# Altium project Relay-Driver-Board-v1.0.PrjPcb (part 1 of 5)
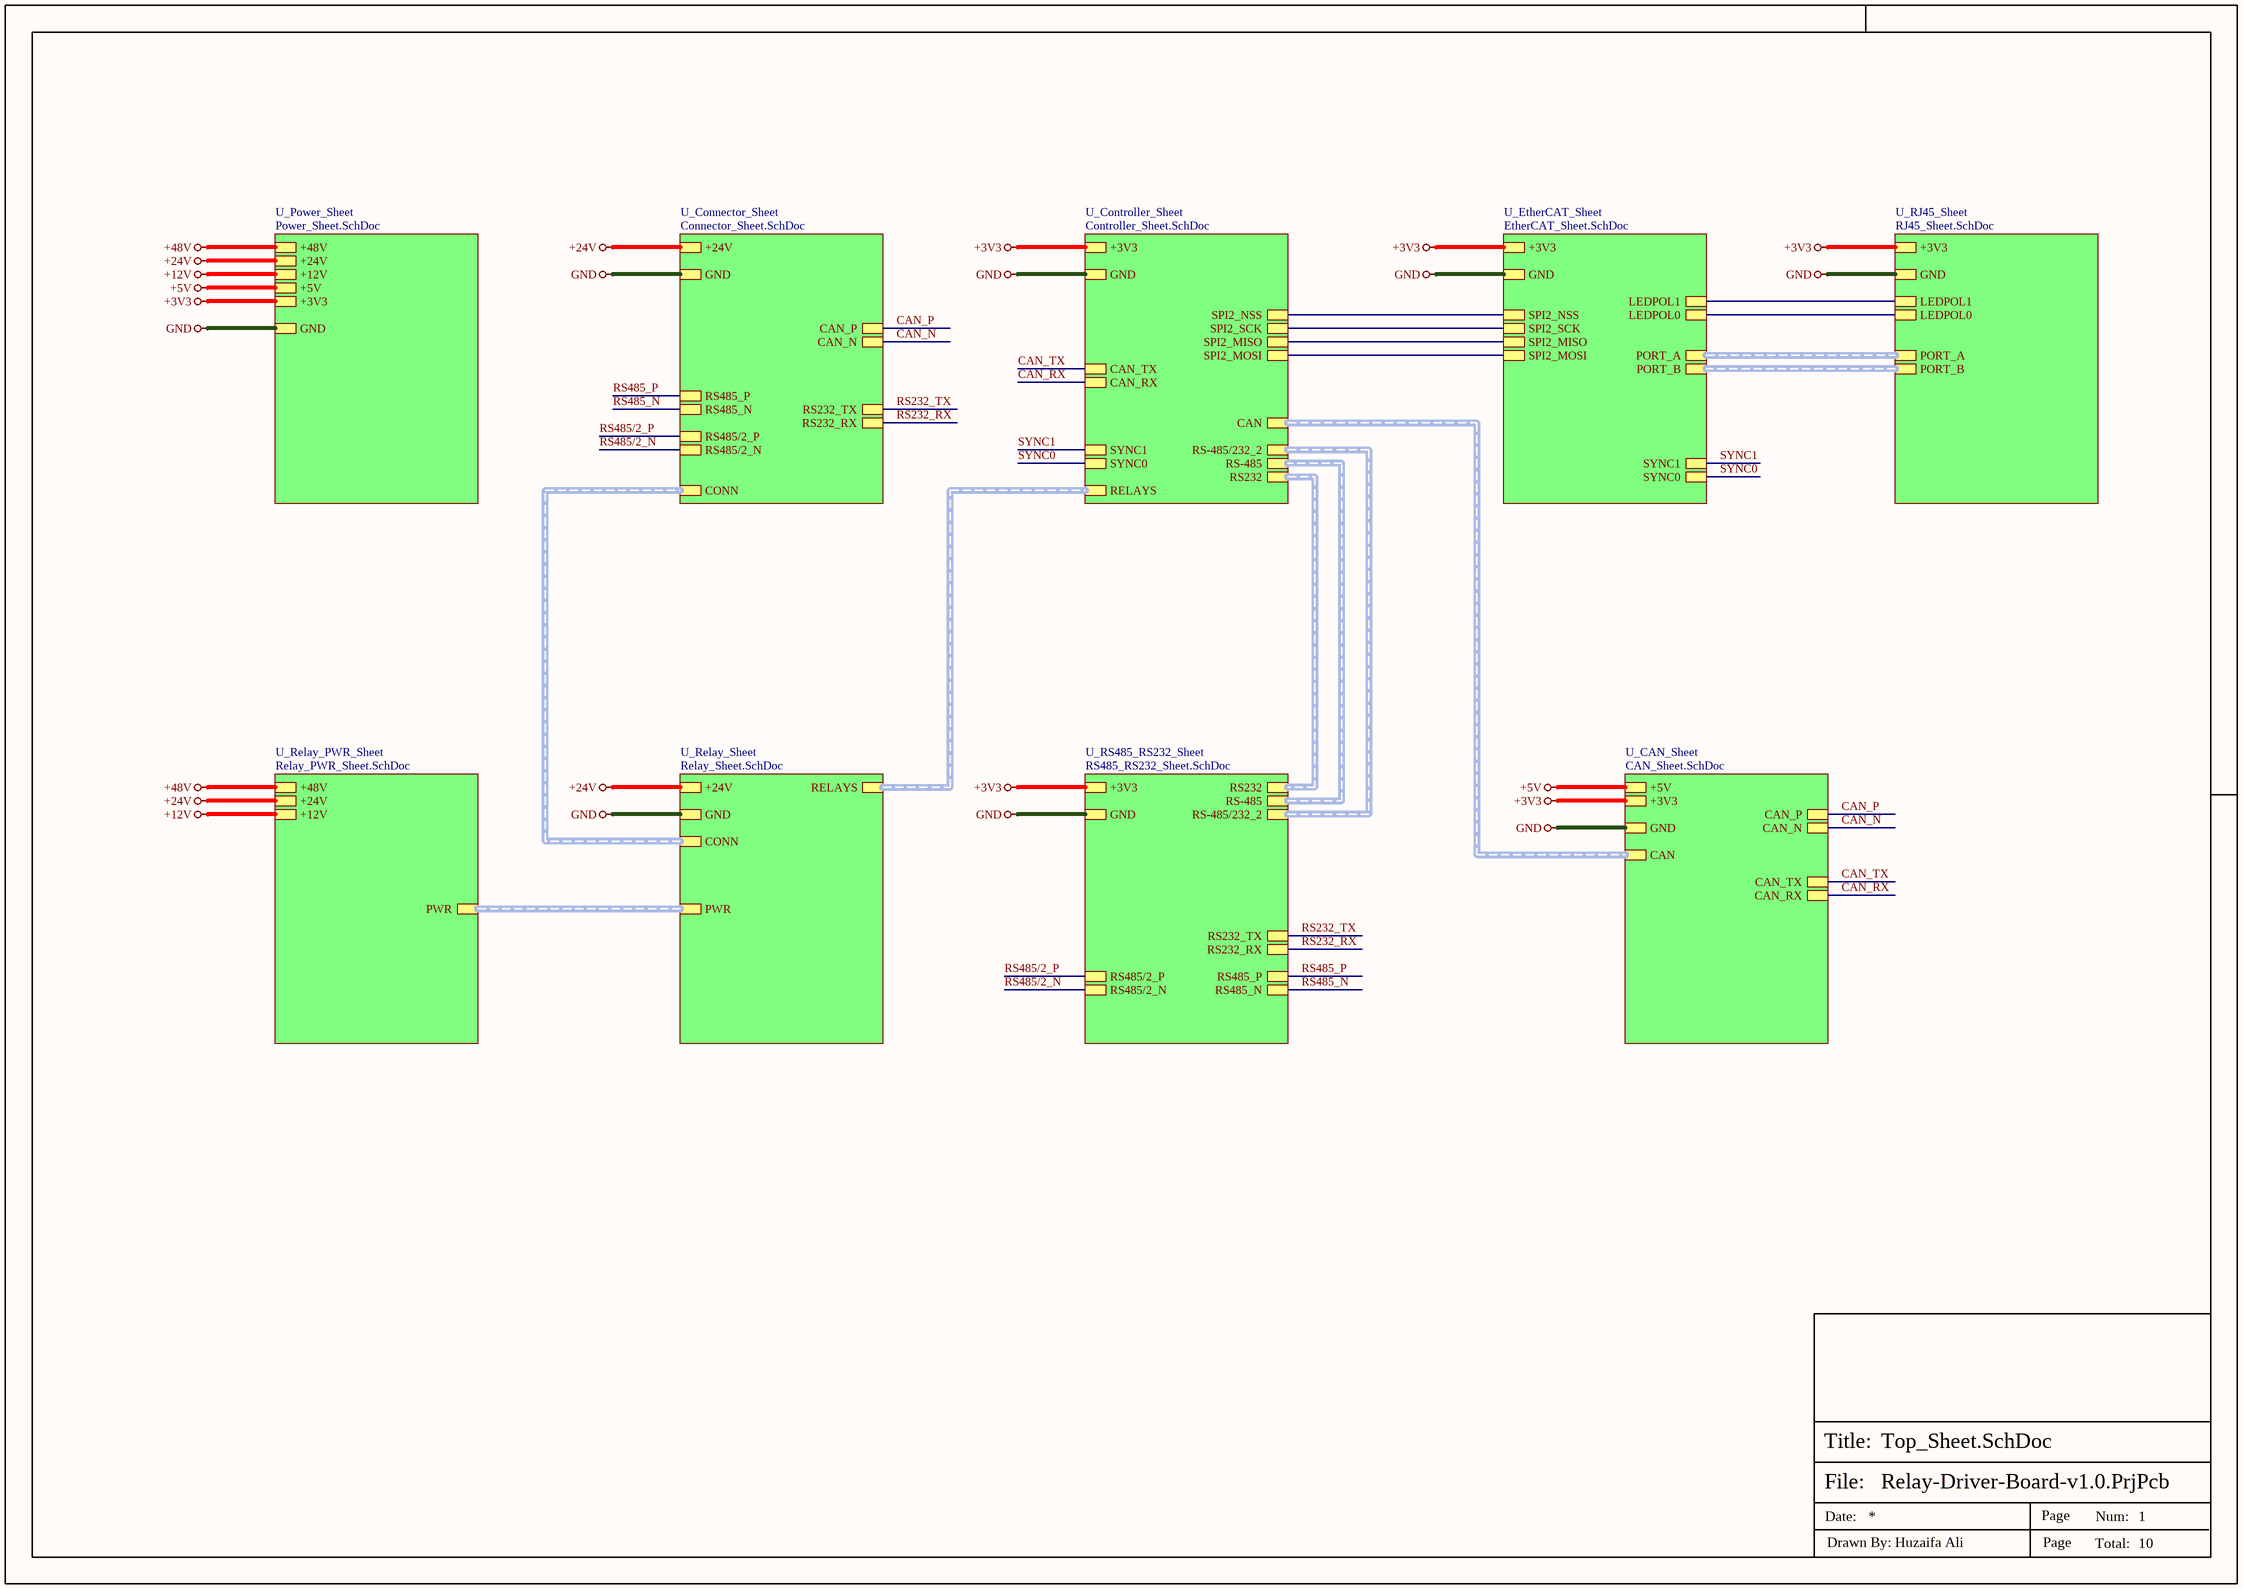
[diagram p0: Top_Sheet.SchDoc]
10 sheets, 294 parts. Net scope: hierarchical (ports join the sheet entries above them; power ports are global).
Sheets:
  Top_Sheet.SchDoc
    U_CAN_Sheet = CAN_Sheet.SchDoc
    U_Connector_Sheet = Connector_Sheet.SchDoc
    U_Controller_Sheet = Controller_Sheet.SchDoc
    U_EtherCAT_Sheet = EtherCAT_Sheet.SchDoc
    U_Power_Sheet = Power_Sheet.SchDoc
    U_Relay_PWR_Sheet = Relay_PWR_Sheet.SchDoc
    U_Relay_Sheet = Relay_Sheet.SchDoc
    U_RS485_RS232_Sheet = RS485_RS232_Sheet.SchDoc
    U_RJ45_Sheet = RJ45_Sheet.SchDoc

## Sheet Top_Sheet.SchDoc
size 420 x 297 mm; SheetNumber: 1; SheetTotal: 10

### Sub-sheets
U_CAN_Sheet = CAN_Sheet.SchDoc: CAN (harness CAN), CAN_RX, CAN_TX, CAN_P, CAN_N, +5V, +3V3, GND
U_Connector_Sheet = Connector_Sheet.SchDoc: RS485/2_N, RS485/2_P, RS485_N, RS485_P, RS232_RX, RS232_TX, CAN_P, CAN_N, GND, +24V, CONN (harness CONN)
U_Controller_Sheet = Controller_Sheet.SchDoc: SPI2_SCK, SPI2_NSS, SPI2_MISO, SPI2_MOSI, RS-485/232_2 (harness RS-485/232_2), RS232 (harness RS232), +3V3, GND, RS-485 (harness RS-485), CAN_RX, CAN_TX, CAN (harness CAN), RELAYS (harness RELAYS), SYNC0, SYNC1
U_EtherCAT_Sheet = EtherCAT_Sheet.SchDoc: PORT_A (harness PORT_A), PORT_B (harness PORT_B), LEDPOL0, LEDPOL1, SPI2_SCK, SPI2_NSS, SPI2_MISO, SPI2_MOSI, +3V3, GND, SYNC0, SYNC1
U_Power_Sheet = Power_Sheet.SchDoc: +12V, +5V, +3V3, GND, +24V, +48V
U_Relay_PWR_Sheet = Relay_PWR_Sheet.SchDoc: PWR (harness PWR), +12V, +24V, +48V
U_Relay_Sheet = Relay_Sheet.SchDoc: RELAYS (harness RELAYS), CONN (harness CONN), PWR (harness PWR), GND, +24V
U_RJ45_Sheet = RJ45_Sheet.SchDoc: PORT_A (harness PORT_A), PORT_B (harness PORT_B), LEDPOL0, LEDPOL1, +3V3, GND
U_RS485_RS232_Sheet = RS485_RS232_Sheet.SchDoc: RS485_N, RS485_P, RS232_RX, RS232_TX, RS-485 (harness RS-485), +3V3, GND, RS485/2_N, RS485/2_P, RS-485/232_2 (harness RS-485/232_2), RS232 (harness RS232)

### Nets
+3V3: sheet U_CAN_Sheet/+3V3, sheet U_Controller_Sheet/+3V3, sheet U_EtherCAT_Sheet/+3V3, sheet U_Power_Sheet/+3V3, sheet U_RS485_RS232_Sheet/+3V3, sheet U_RJ45_Sheet/+3V3
+5V: sheet U_CAN_Sheet/+5V, sheet U_Power_Sheet/+5V
+12V: sheet U_Power_Sheet/+12V, sheet U_Relay_PWR_Sheet/+12V
+24V: sheet U_Connector_Sheet/+24V, sheet U_Power_Sheet/+24V, sheet U_Relay_PWR_Sheet/+24V, sheet U_Relay_Sheet/+24V
+48V: sheet U_Power_Sheet/+48V, sheet U_Relay_PWR_Sheet/+48V
CAN_RX: sheet U_CAN_Sheet/CAN_RX, sheet U_Controller_Sheet/CAN_RX
CAN_TX: sheet U_CAN_Sheet/CAN_TX, sheet U_Controller_Sheet/CAN_TX
GND: sheet U_CAN_Sheet/GND, sheet U_Connector_Sheet/GND, sheet U_Controller_Sheet/GND, sheet U_EtherCAT_Sheet/GND, sheet U_Power_Sheet/GND, sheet U_Relay_Sheet/GND, sheet U_RS485_RS232_Sheet/GND, sheet U_RJ45_Sheet/GND
RS232_RX: sheet U_Connector_Sheet/RS232_RX, sheet U_RS485_RS232_Sheet/RS232_RX
RS232_TX: sheet U_Connector_Sheet/RS232_TX, sheet U_RS485_RS232_Sheet/RS232_TX
CAN_N: sheet U_CAN_Sheet/CAN_N, sheet U_Connector_Sheet/CAN_N
CAN_P: sheet U_CAN_Sheet/CAN_P, sheet U_Connector_Sheet/CAN_P
LEDPOL0: sheet U_EtherCAT_Sheet/LEDPOL0, sheet U_RJ45_Sheet/LEDPOL0
LEDPOL1: sheet U_EtherCAT_Sheet/LEDPOL1, sheet U_RJ45_Sheet/LEDPOL1
RS485/2_N: sheet U_Connector_Sheet/RS485/2_N, sheet U_RS485_RS232_Sheet/RS485/2_N
RS485/2_P: sheet U_Connector_Sheet/RS485/2_P, sheet U_RS485_RS232_Sheet/RS485/2_P
RS485_N: sheet U_Connector_Sheet/RS485_N, sheet U_RS485_RS232_Sheet/RS485_N
RS485_P: sheet U_Connector_Sheet/RS485_P, sheet U_RS485_RS232_Sheet/RS485_P
SPI2_MISO: sheet U_Controller_Sheet/SPI2_MISO, sheet U_EtherCAT_Sheet/SPI2_MISO
SPI2_MOSI: sheet U_Controller_Sheet/SPI2_MOSI, sheet U_EtherCAT_Sheet/SPI2_MOSI
SPI2_NSS: sheet U_Controller_Sheet/SPI2_NSS, sheet U_EtherCAT_Sheet/SPI2_NSS
SPI2_SCK: sheet U_Controller_Sheet/SPI2_SCK, sheet U_EtherCAT_Sheet/SPI2_SCK
SYNC0: sheet U_Controller_Sheet/SYNC0, sheet U_EtherCAT_Sheet/SYNC0
SYNC1: sheet U_Controller_Sheet/SYNC1, sheet U_EtherCAT_Sheet/SYNC1

### Buses and harness runs
harness sheet U_CAN_Sheet/CAN = sheet U_Controller_Sheet/CAN
harness sheet U_Connector_Sheet/CONN = sheet U_Relay_Sheet/CONN
harness sheet U_Controller_Sheet/RELAYS = sheet U_Relay_Sheet/RELAYS
harness sheet U_Controller_Sheet/RS232 = sheet U_RS485_RS232_Sheet/RS232
harness sheet U_Controller_Sheet/RS-485 = sheet U_RS485_RS232_Sheet/RS-485
harness sheet U_Controller_Sheet/RS-485/232_2 = sheet U_RS485_RS232_Sheet/RS-485/232_2
harness sheet U_EtherCAT_Sheet/PORT_A = sheet U_RJ45_Sheet/PORT_A
harness sheet U_EtherCAT_Sheet/PORT_B = sheet U_RJ45_Sheet/PORT_B
harness sheet U_Relay_PWR_Sheet/PWR = sheet U_Relay_Sheet/PWR

### Notes on the sheet
- File:
- Title:
- Date:
- Page
- Num:
- Total:
- Drawn By: Huzaifa Ali

## Sheet CAN_Sheet.SchDoc
size 420 x 297 mm; SheetNumber: 4; SheetTotal: 10
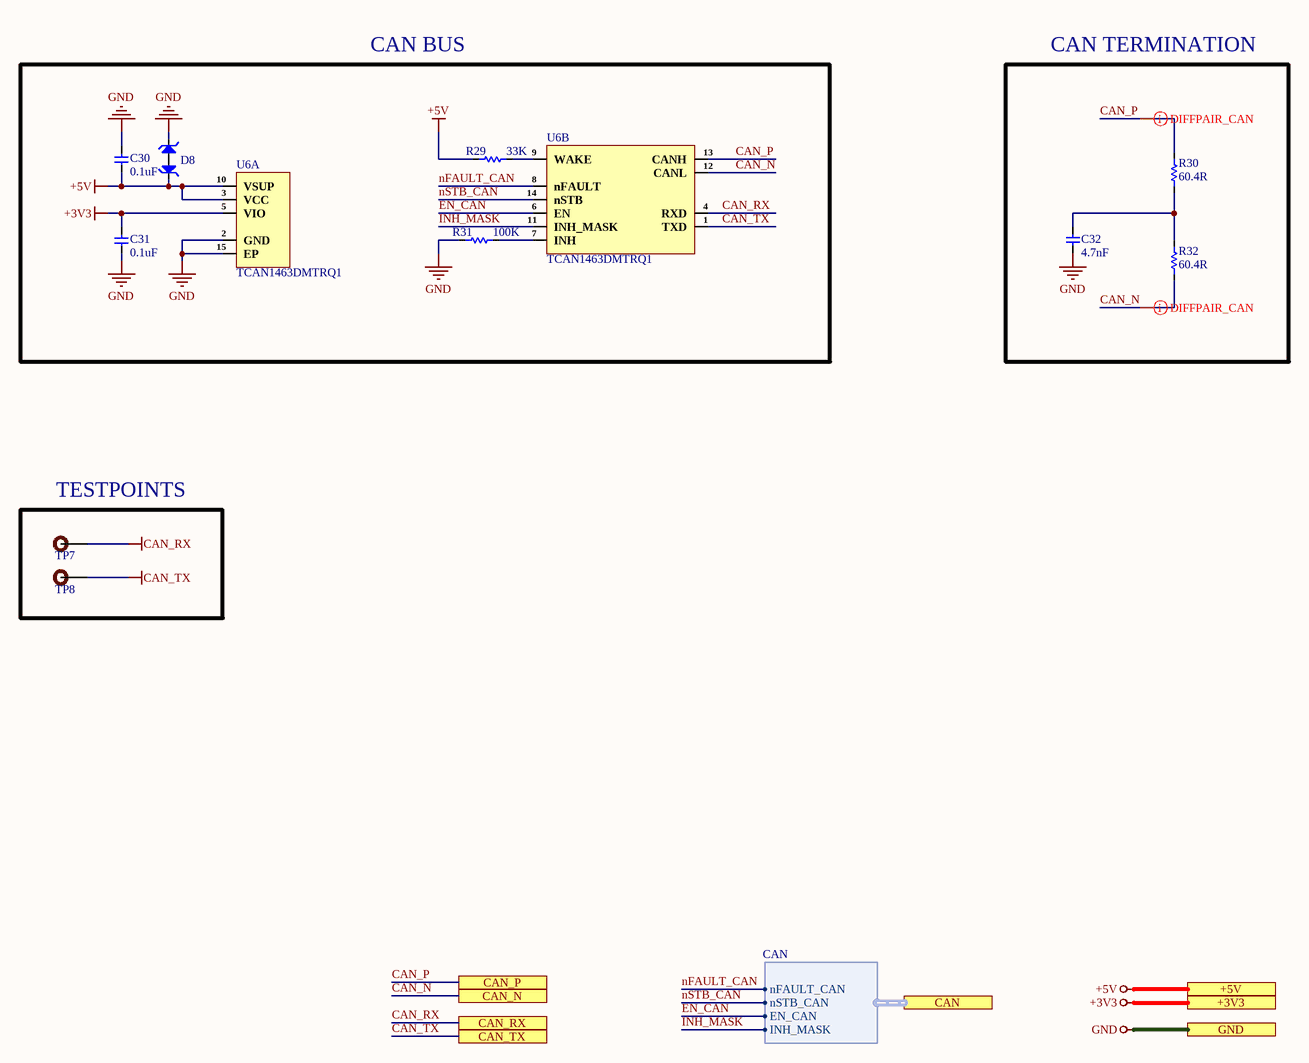
[diagram p1: CAN_Sheet.SchDoc]

### Parts
C30  0.1uF  [Cap-0402]
C31  0.1uF  [Cap-0402]
C32  4.7nF  [Cap-0402]
D8  PESD5V0H1BSFYL  [DSN0603-2]  (value not drawn)
R29  33K  [Res-0402]
R30  60.4R  [Res-0603]
R31  100K  [Res-0402]
R32  60.4R  [Res-0603]
TP7  TEST POINT  [Test-point]  (value not drawn)  (no BOM)
TP8  TEST POINT  [Test-point]  (value not drawn)  (no BOM)
U6  TCAN1463DMTRQ1  [VSON-14(3x4.5)]  (parts A,B of 2)

### Ports
+3V3 (see Top_Sheet[5C], Controller_Sheet[5D], EtherCAT_Sheet[5D], Power_Sheet[5D], RJ45_Sheet[5D], RS485_RS232_Sheet[5D]), +5V (see Top_Sheet[5B], Power_Sheet[5D]), CAN (harness CAN, see Top_Sheet[5C], Controller_Sheet[3D]), CAN_N (see Top_Sheet[5C], Connector_Sheet[3D]), CAN_P (see Top_Sheet[5C], Connector_Sheet[3D]), CAN_RX (see Top_Sheet[5C], Controller_Sheet[2D]), CAN_TX (see Top_Sheet[5C], Controller_Sheet[2D]), GND (see Top_Sheet[5C], Connector_Sheet[5D], Controller_Sheet[5D], EtherCAT_Sheet[5D], Power_Sheet[5D], Relay_Sheet[5D], RJ45_Sheet[5D], RS485_RS232_Sheet[5D])

### Harnesses
CAN: nFAULT_CAN, nSTB_CAN, EN_CAN, INH_MASK

### Nets
+3V3: C31.2 U6.5(VIO) ; port +3V3
+5V: C30.1 D8.1 R29.1 U6.3(VCC) U6.10(VSUP) ; port +5V
CAN_RX: TP7.1 U6.4(RXD) ; port CAN_RX
CAN_TX: TP8.1 U6.1(TXD) ; port CAN_TX
GND: C30.2 C31.1 C32.2 D8.2 R31.1 U6.2(GND) U6.15(EP) ; port GND
CAN_N: R32.2 U6.12(CANL) ; port CAN_N
CAN_P: R30.1 U6.13(CANH) ; port CAN_P
EN_CAN: U6.6(EN) ; port CAN.EN_CAN
INH_MASK: U6.11(INH_MASK) ; port CAN.INH_MASK
nFAULT_CAN: U6.8(nFAULT) ; port CAN.nFAULT_CAN
nSTB_CAN: U6.14(nSTB) ; port CAN.nSTB_CAN
NetC32_1: C32.1 R30.2 R32.1
NetR29_2: R29.2 U6.9(WAKE)
NetR31_2: R31.2 U6.7(INH)

### Layout directives
differential pair; net class CAN; differential pair class CAN_Lines: CAN_N, CAN_P

### Notes on the sheet
- CAN BUS
- CAN TERMINATION
- (near TP7) TESTPOINTS
- File:
- Title:
- Date:
- Page
- Num:
- Total:
- Drawn By: Huzaifa Ali

### Library data of the parts
C30 C31 = CC0402JRX7R7BB104: CAP CER 0.1UF 16V X7R 0402; Manufacturer: Yageo; Material: 4241ConductorMaterial; Value: 100nF; Tolerance: 5%; Item Type: Capacitor; Supplier: Digikey; Supplier Part Number: 311-1676-1-ND; Manufacturer Part Number: CC0402JRX7R7BB104; RoHS: Yes; Category: Ceramic Capacitors; Stock: 1659111; Pricing: 1=0.1, 10=0.046, 50=0.0262, 100=0.0203, 500=0.01528, 1000=0.012, 2500=0.01091, 5000=0.01004 (USD); Mounting Technology: Surface Mount; Case/Package: 0402; Case Code (Metric): 1005; Case Code (Imperial): 0402; Min Operating Temperature: -55°C; Max Operating Temperature: 125°C; Dielectric: X7R; Packaging: Tape and Reel; Package Quantity: 10000; Voltage Rating (DC): 16V; Voltage Rating: 16V; Series: CC; Construction: Flat; Length: 0.039inch; Width: 0.02inch; Height: 0.5mm; Thickness: 0.022inch; Lead Free: Lead Free; Halogen Free: Halogen Free; RoHS Compliant: Yes; ComponentLink1URL: https://datasheet.ciiva.com/13210/upy-gphc-x7r-6-3v-to-50v-8-12304-13210152.pdf?src-supplier=Mouser; ComponentLink1Description: https://datasheet.ciiva.com/13210/upy-gphc-x7r-6-3v-to-50v-8-12304-13210152.pdf?src-supplier=Mouser; LCSC Part Number: C541464
C32 = CC0402KRX7R9BB472: CAP CER 4700PF 50V X7R 0402; Manufacturer: Yageo; Material: 4241ConductorMaterial; Tolerance: 10%; Temperature Coefficient: 30ppm/°C; Item Type: Capacitor; Supplier 1: Future Electronics; Manufacturer Part Number: CC0402KRX7R9BB472; RoHS: Yes; Category: Ceramic Capacitors; Stock 1: 1780000; Pricing 1: 10000=0.0021, 40000=0.002, 150000=0.0019, 400000=0.0018, 1000000=0.0017 (USD); Mount: Surface Mount; Case/Package: 0402; Number of Pins: 2NUMBER; Case Code (Imperial): 0402; Case Code (Metric): 1005; Min Operating Temperature: -55°C; Max Operating Temperature: 125°C; Capacitance: 4.7nF; Dielectric: X7R; Voltage Rating: 50V; Voltage Rating (DC): 50V; Packaging: Tape and Reel; Package Quantity: 1; Termination: SMD/SMT; Series: CC; Construction: Flat; Length: 1mm; Width: 0.02inch; Height: 0.5mm; Thickness: 0.022inch; Depth: 0.5mm; Radiation Hardening: No; Reach SVHC Compliant: No; RoHS Compliant: Yes; Halogen Free: 5694HalogenFree; Lead Free: 5697LeadFree; ComponentLink1URL: https://datasheet.ciiva.com/7978/1489800-7978108.pdf?src-supplier=Element14; ComponentLink1Description: https://datasheet.ciiva.com/7978/1489800-7978108.pdf?src-supplier=Element14; ComponentLink2URL: https://datasheet.ciiva.com/176/mlccorderingcode-176364.pdf?src-supplier=Digikey; ComponentLink2Description: https://datasheet.ciiva.com/176/mlccorderingcode-176364.pdf?src-supplier=Digikey; ComponentLink3URL: https://datasheet.ciiva.com/176/mlccorderingcode-176363.pdf?src-supplier=Digikey; ComponentLink3Description: https://datasheet.ciiva.com/176/mlccorderingcode-176363.pdf?src-supplier=Digikey; ComponentLink4URL: https://datasheet.ciiva.com/176/mlccorderingcode-176365.pdf?src-supplier=Digikey; ComponentLink4Description: https://datasheet.ciiva.com/176/mlccorderingcode-176365.pdf?src-supplier=Digikey; ComponentLink5URL: https://datasheet.ciiva.com/11586/upy-gphc-x7r-6-3v-to-50v-8-11586491.pdf?src-supplier=Avnet; ComponentLink5Description: https://datasheet.ciiva.com/11586/upy-gphc-x7r-6-3v-to-50v-8-11586491.pdf?src-supplier=Avnet; Supplier Part Number 1: 1989300
D8 = PESD5V0H1BSFYL: TVS DIODE 5VWM 6.3VC DSN0603-2; Manufacturer: Nexperia; Supplier 1: Avnet; Manufacturer Part Number: PESD5V0H1BSFYL; RoHS: Yes; Category: ESD and Circuit Protection ICs; Stock 1: 9000; Pricing 1: 18000=0.06453, 36000=0.06278, 54000=0.06104, 90000=0.05930, 180000=0.05755, 900000=0.05581, 1800000=0.05406 (USD); RoHS Compliant: Yes; ComponentLink1URL: http://www.farnell.com/datasheets/1961312.pdf?src-supplier=Farnell; ComponentLink1Description: http://www.farnell.com/datasheets/1961312.pdf?src-supplier=Farnell; ComponentLink2URL: https://assets.nexperia.com/documents/data-sheet/PESD5V0H1BSF.pdf?src-supplier=Digi-Key; ComponentLink2Description: https://assets.nexperia.com/documents/data-sheet/PESD5V0H1BSF.pdf?src-supplier=Digi-Key; ComponentLink3URL: http://www.farnell.com/datasheets/1961312.pdf?src-supplier=Newark; ComponentLink3Description: http://www.farnell.com/datasheets/1961312.pdf?src-supplier=Newark; Supplier Part Number 1: PESD5V0H1BSFYL; LCSC Part Number: C477989; Item Type: Diode
R29 = RC0402FR-0733KL: RES 33K OHM 1% 1/16W 0402; Manufacturer: YAGEO; Item Type: Resistor; Manufacturer Part Number: RC0402FR-0733KL; Package: 0402; LCSC Part Number: C138003; ComponentLink1Description: LCSC; ComponentLink1URL: https://www.lcsc.com/product-detail/Chip-Resistor-Surface-Mount_YAGEO-RC0402FR-0733KL_C138003.html
R30 R32 = RTT0360R4FTP: 100mW Thick Film Resistors ±100ppm/℃ ±1% 60.4Ω 0603 Chip Resistor - Surface Mount ROHS; Manuacturer: RALEC; Manufacturer Part Number: RTT0360R4FTP; Package: 0603; Value: 60.4R; LCSC Part Number: C103744; ComponentLink1Description: LCSC; ComponentLink1URL: https://www.lcsc.com/product-detail/Chip-Resistor-Surface-Mount_RALEC-RTT0360R4FTP_C103744.html
R31 = RC0402FR-07100KL: RES 100K OHM 1% 1/16W 0402; Manufacturer: Yageo; Resistance: 100kR; Temperature Coefficient: 100ppm/°C; Power Rating: 63mW; Voltage Rating: 50V; Item Type: Resistor; Supplier 1: Mouser; Manufacturer Part Number: RC0402FR-07100KL; RoHS: Yes; Category: Chip SMD Resistors; Stock 1: 7759549; Pricing 1: 1=0.10000, 10=0.01200, 50=0.01200, 100=0.00500, 1000=0.00300, 2500=0.00200, 10000=0.00100 (USD); Case/Package: 0402; Case Code (Metric): 1005; Case Code (Imperial): 0402; Min Operating Temperature: -55°C; Max Operating Temperature: 155°C; Resistor Type: Thick Film; Tolerance: 1%; Packaging: Tape and Reel; Package Quantity: 1; Number of Terminations: 2; Termination: SMD/SMT; Max Power Dissipation: 63mW; Working Voltage: 50V; Features: Moisture Resistant; Series: RC; Resistance Tolerance: 1%; Construction: Rectangular; Technology: THICK FILM; Length: 0.039inch; Width: 0.02inch; Height: 0.016inch; Depth: 0.5mm; REACH SVHC: No SVHC; Lead Free: Lead Free; RoHS Compliant: Yes; Military Standard: Not; ComponentLink1URL: https://datasheet.ciiva.com/11819/0900766b80c66297-11819452.pdf?src-supplier=RSComponents; ComponentLink1Description: https://datasheet.ciiva.com/11819/0900766b80c66297-11819452.pdf?src-supplier=RSComponents; ComponentLink2URL: https://datasheet.ciiva.com/22747/1018594-22747509.pdf?src-supplier=Element14; ComponentLink2Description: https://datasheet.ciiva.com/22747/1018594-22747509.pdf?src-supplier=Element14; ComponentLink3URL: https://datasheet.ciiva.com/2453/pyu-r-int-thick-7-2453362.pdf?src-supplier=Digi-Key; ComponentLink3Description: https://datasheet.ciiva.com/2453/pyu-r-int-thick-7-2453362.pdf?src-supplier=Digi-Key; ComponentLink4URL: https://datasheet.ciiva.com/2453/pyu-r-int-thick-7-2453363.pdf?src-supplier=Digi-Key; ComponentLink4Description: https://datasheet.ciiva.com/2453/pyu-r-int-thick-7-2453363.pdf?src-supplier=Digi-Key; ComponentLink5URL: https://datasheet.ciiva.com/2453/pyu-r-int-thick-7-2453361.pdf?src-supplier=Digi-Key; ComponentLink5Description: https://datasheet.ciiva.com/2453/pyu-r-int-thick-7-2453361.pdf?src-supplier=Digi-Key; ComponentLink6URL: https://datasheet.ciiva.com/12667/pyu-rc0402-51-rohs-l-6-r-12667930.pdf?src-supplier=Mouser; ComponentLink6Description: https://datasheet.ciiva.com/12667/pyu-rc0402-51-rohs-l-6-r-12667930.pdf?src-supplier=Mouser; ComponentLink7URL: https://datasheet.ciiva.com/15189/getdatasheetpartid-323696-15189334.pdf?src-supplier=Verical; ComponentLink7Description: https://datasheet.ciiva.com/15189/getdatasheetpartid-323696-15189334.pdf?src-supplier=Verical; Supplier Part Number 1: 603-RC0402FR-07100KL; LCSC Part Number: C60491
TP7 TP8 = TEST POINT: Test Point ON; Item Type: TEST POINT
U6 = TCAN1463DMTRQ1: IC TRANSCEIVER HALF 1/1 14VSON; Manufacturer: Texas Instruments; Supplier: Mouser; Supplier Part Number: 595-TCAN1463DMTRQ1; Manufacturer Part Number: TCAN1463DMTRQ1; RoHS: Yes; Item Type: IC; Stock: 20610; Pricing: 1=2.47, 10=2.22, 50=2.22, 100=1.78, 1000=1.21, 10000=1.09 (USD); LCSC Part Number: C5215823

## Sheet Connector_Sheet.SchDoc
size 420 x 297 mm; SheetNumber: 10; SheetTotal: 10
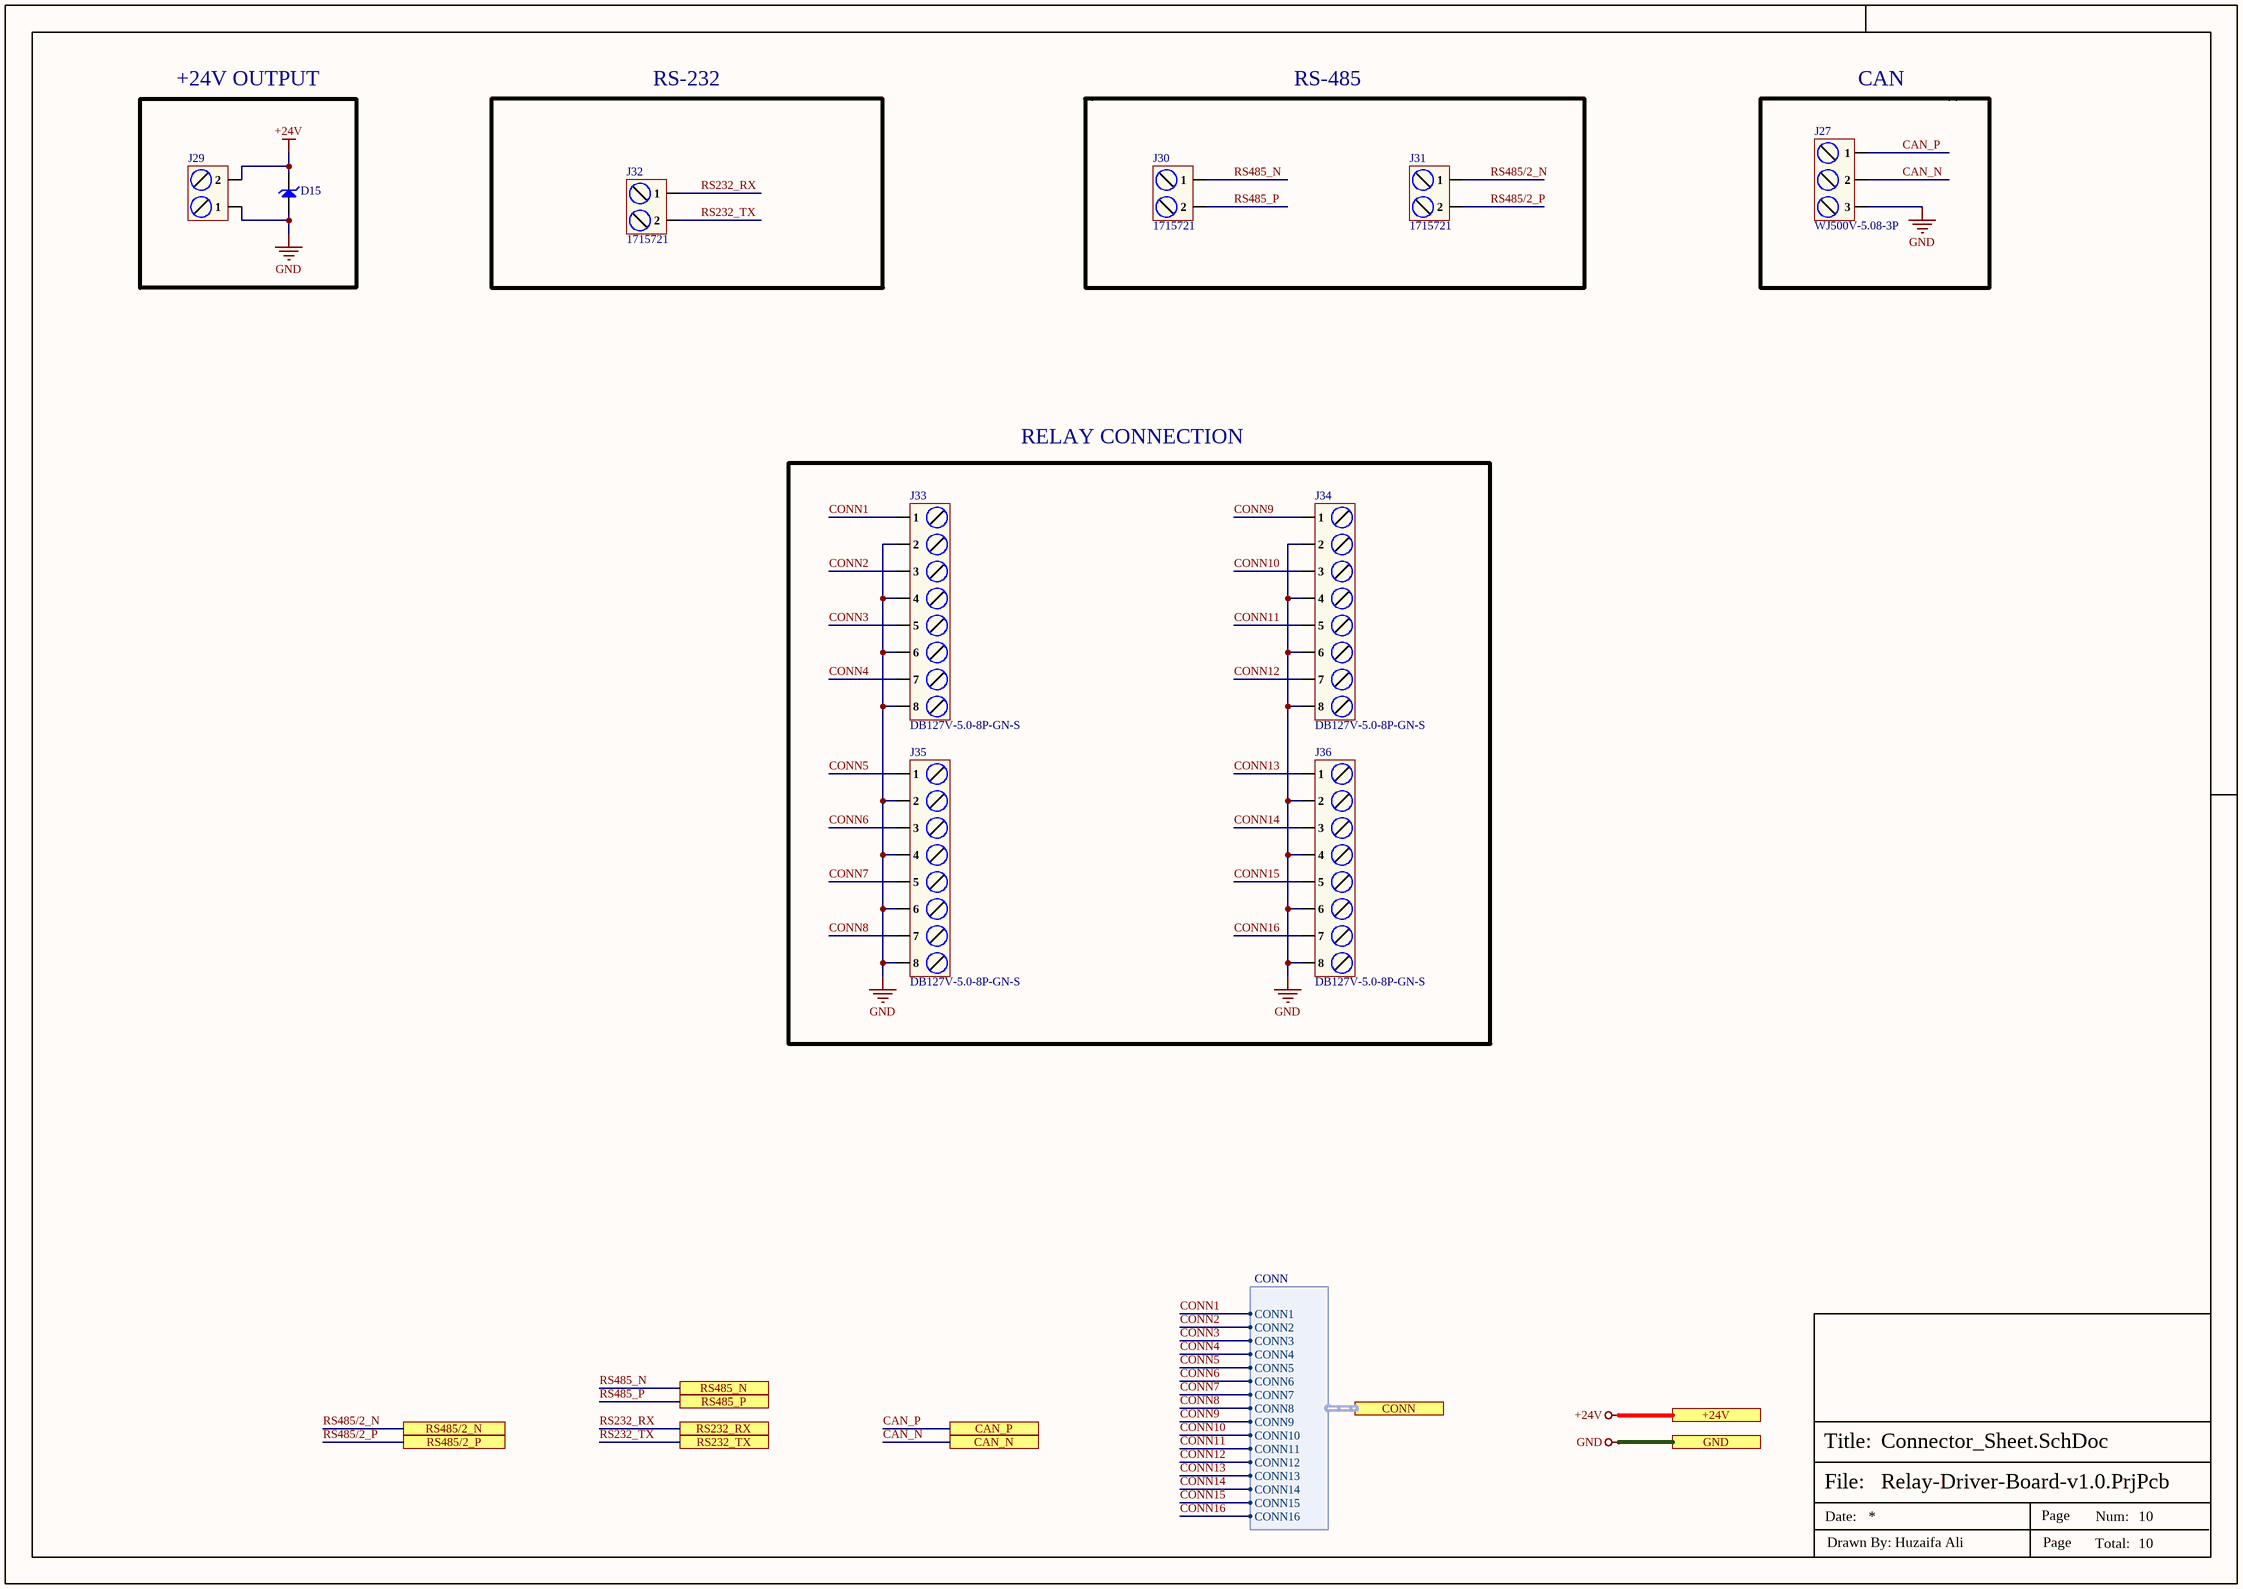
[diagram p2: Connector_Sheet.SchDoc]

### Parts
D15  SMBJ28A-13-F  [SMB_]  (value not drawn)
J27  WJ500V-5.08-3P  [WJ500V-5.08-3P]
J29  MXHB9500-9.5-02P-BK01-Cu-S-A  [MXHB9500-9.5-02P-BK01-Cu-S-A]  (value not drawn)
J30  1715721  [1715721]
J31  1715721  [1715721]
J32  1715721  [1715721]
J33  DB127V-5.0-8P-GN-S  [DB127V-5.0-8P-GN-S]
J34  DB127V-5.0-8P-GN-S  [DB127V-5.0-8P-GN-S]
J35  DB127V-5.0-8P-GN-S  [DB127V-5.0-8P-GN-S]
J36  DB127V-5.0-8P-GN-S  [DB127V-5.0-8P-GN-S]

### Ports
+24V (see Top_Sheet[2A], Power_Sheet[5D], Relay_PWR_Sheet[5D], Relay_Sheet[5D]), CAN_N (see Top_Sheet[3A], CAN_Sheet[3D]), CAN_P (see Top_Sheet[3A], CAN_Sheet[3D]), CONN (harness CONN, see Top_Sheet[2B], Relay_Sheet[2D]), GND (see Top_Sheet[2A], CAN_Sheet[5D], Controller_Sheet[5D], EtherCAT_Sheet[5D], Power_Sheet[5D], Relay_Sheet[5D], RJ45_Sheet[5D], RS485_RS232_Sheet[5D]), RS232_RX (see Top_Sheet[3B], RS485_RS232_Sheet[2D]), RS232_TX (see Top_Sheet[3B], RS485_RS232_Sheet[2D]), RS485/2_N (see Top_Sheet[2B], RS485_RS232_Sheet[1D]), RS485/2_P (see Top_Sheet[2B], RS485_RS232_Sheet[1D]), RS485_N (see Top_Sheet[2B], RS485_RS232_Sheet[1D]), RS485_P (see Top_Sheet[2A], RS485_RS232_Sheet[1D])

### Harnesses
CONN: CONN1, CONN2, CONN3, CONN4, CONN5, CONN6, CONN7, CONN8, CONN9, CONN10, CONN11, CONN12, CONN13, CONN14, CONN15, CONN16

### Nets
+24V: D15.2(K) J29.2 ; port +24V
GND: D15.1(A) J27.3 J29.1 J33.2 J33.4 J33.6 J33.8 J34.2 J34.4 J34.6 J34.8 J35.2 J35.4 J35.6 J35.8 J36.2 J36.4 J36.6 J36.8 ; port GND
RS232_RX: J32.1 ; port RS232_RX
RS232_TX: J32.2 ; port RS232_TX
CAN_N: J27.2 ; port CAN_N
CAN_P: J27.1 ; port CAN_P
CONN1: J33.1 ; port CONN.CONN1
CONN2: J33.3 ; port CONN.CONN2
CONN3: J33.5 ; port CONN.CONN3
CONN4: J33.7 ; port CONN.CONN4
CONN5: J35.1 ; port CONN.CONN5
CONN6: J35.3 ; port CONN.CONN6
CONN7: J35.5 ; port CONN.CONN7
CONN8: J35.7 ; port CONN.CONN8
CONN9: J34.1 ; port CONN.CONN9
CONN10: J34.3 ; port CONN.CONN10
CONN11: J34.5 ; port CONN.CONN11
CONN12: J34.7 ; port CONN.CONN12
CONN13: J36.1 ; port CONN.CONN13
CONN14: J36.3 ; port CONN.CONN14
CONN15: J36.5 ; port CONN.CONN15
CONN16: J36.7 ; port CONN.CONN16
RS485/2_N: J31.1 ; port RS485/2_N
RS485/2_P: J31.2 ; port RS485/2_P
RS485_N: J30.1 ; port RS485_N
RS485_P: J30.2 ; port RS485_P

### Notes on the sheet
- +24V OUTPUT
- RS-232
- RS-485
- CAN
- RELAY CONNECTION
- File:
- Title:
- Date:
- Page
- Num:
- Total:
- Drawn By: Huzaifa Ali

### Library data of the parts
D15 = SMBJ28A-13-F: TVS DIODE 28VWM 45.4VC SMB; Manufacturer: Diodes; Test Current: 1mA; Number of Elements: 1; Power Dissipation: 600W; Forward Voltage: 5V; Direction: Unidirectional; Reverse Breakdown Voltage: 31.1V; Max Surge Current: 13.2A; Reverse Standoff Voltage: 28V; Clamping Voltage: 45.4V; Power Line Protection: No; Breakdown Voltage: 35.8V; Max Reverse Leakage Current: 5uA; Value: 330pF; Diode Type: ZENER; Supplier: Future Electronics; Supplier Part Number: 8797342; Manufacturer Part Number: SMBJ28A-13-F; RoHS: Yes; Category: TVS Diodes; Stock: 39000; Pricing: 3000=0.0734, 9000=0.0706, 15000=0.0693, 30000=0.0676, 60000=0.065 (USD); Mounting Technology: Surface Mount; Case/Package: SMB; Pins: 2; Min Operating Temperature: -55°C; Max Operating Temperature: 150°C; Packaging: Tape and Reel; Package Quantity: 3000; Max Power Dissipation: 600W; Series: SMBJ; Number of Unidirectional Channels: 1; Min Breakdown Voltage: 31.1V; Peak Pulse Power: 600W; Polarity: Unidirectional; Termination: SMD/SMT; Peak Pulse Current: 13.2A; Max Breakdown Voltage: 35.8V; Leakage Current: 5uA; Working Voltage: 28V; Voltage Rating (DC): 28V; Max Output current: 13.2A; Clamping Voltage-Max: 45.4V; Length: 4.57mm; Width: 3.9mm; Height: 2.62mm; Radiation Hardening: No; RoHS Compliant: Yes; Lead Free: Lead Free; ComponentLink1URL: https://datasheet.ciiva.com/16387/ds19002-16387564.pdf?src-supplier=Future+Electronics; ComponentLink1Description: https://datasheet.ciiva.com/16387/ds19002-16387564.pdf?src-supplier=Future+Electronics; ComponentLink2URL: https://datasheet.ciiva.com/26912/getdatasheetpartid-234000-26912533.pdf?src-supplier=Verical; ComponentLink2Description: https://datasheet.ciiva.com/26912/getdatasheetpartid-234000-26912533.pdf?src-supplier=Verical; Item Type: Diode
J27 = WJ500V-5.08-3P: 1x3P 18A -40℃~+105℃ 250V Green 14~30 Straight pin 5.08mm 2.5 1 3 Plugin,P=5.08mm Screw terminal ROHS; Manufacturer: Ningbo Kangnex Elec; Item Type: Terminal Block; Manufacturer Part Number: WJ500V-5.08-3P; Package: Plugin,P=5.08mm; LCSC Part Number: C72334; ComponentLink1Description: LCSC; ComponentLink1URL: https://www.lcsc.com/product-detail/Screw-terminal_Ningbo-Kangnex-Elec-WJ500V-5-08-3P_C72334.html
J29 = MXHB9500-9.5-02P-BK01-Cu-S-A: Tin 1x2P Corner pin Three sides 2 1 9.5mm -40℃~+105℃ 20A 300V Black 10~22 Copper Alloy 0.5~4 Plugin,P=9.5mm Barrier Terminal Blocks ROHS; Manufacturer: MAX; Manufacturer Part Number: MXHB9500-9.5-02P-BK01-Cu-S-A; Package: Plugin,P=9.5mm; LCSC Part Number: C7542168; Item Type: Terminal Block; ComponentLink1Description: LCSC; ComponentLink1URL: https://www.lcsc.com/product-detail/Barrier-Terminal-Blocks_MAX-MXHB9500-9-5-02P-BK01-Cu-S-A_C7542168.html
J30-J32 = 1715721: TERM BLK 2P SIDE ENT 5.08MM PCB; Manufacturer: Phoenix Contact; Item Type: Terminal Blocks; Supplier: Digikey; Supplier Part Number: 277-1263-ND; Manufacturer Part Number: 1715721; RoHS: Yes; Stock: 13160; Pricing: 1=0.94 (USD); ComponentLink1URL: https://datasheet.ciiva.com/1120/1697161-1120393.pdf?src-supplier=Farnell; ComponentLink1Description: https://datasheet.ciiva.com/1120/1697161-1120393.pdf?src-supplier=Farnell; ComponentLink2URL: https://datasheet.ciiva.com/832/1715721-832095.pdf?src-supplier=Digikey; ComponentLink2Description: https://datasheet.ciiva.com/832/1715721-832095.pdf?src-supplier=Digikey; ComponentLink3URL: https://datasheet.ciiva.com/15169/getdatasheetpartid-212174-15169929.pdf?src-supplier=Verical; ComponentLink3Description: https://datasheet.ciiva.com/15169/getdatasheetpartid-212174-15169929.pdf?src-supplier=Verical; ComponentLink4URL: https://datasheet.ciiva.com/16046/1715721-16046034.pdf?src-supplier=Onlinecomponents.com; ComponentLink4Description: https://datasheet.ciiva.com/16046/1715721-16046034.pdf?src-supplier=Onlinecomponents.com
J33-J36 = DB127V-5.0-8P-GN-S: 1x8P -40℃~+105℃ 15A 250V Green 14~26 Straight 5mm 1.5 1 8 Plugin,P=5mm Screw Terminal Blocks ROHS; Manufacturer: DIBO; Supplier: LCSC; LCSC Part Number: C430626; Manufacturer Part Number: DB127V-5.0-8P-GN-S; RoHS: No; Item Type: Terminal Block